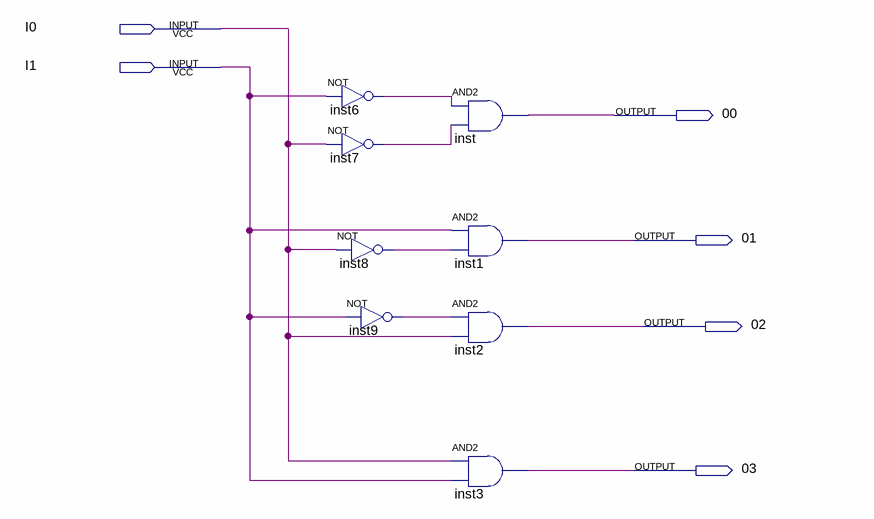
[diagram p0: schematic sheet]
// Quartus schematic decoder_2x4.bdf as structural Verilog: 8 symbols, 6 pins
module decoder_2x4 (
  input  I0,
  input  I1,
  output \00 ,
  output \01 ,
  output \02 ,
  output \03 
);

  wire inst6_out, inst7_out, inst8_out, inst9_out;

  not inst6 (inst6_out, I1);
  not inst7 (inst7_out, I0);
  not inst8 (inst8_out, I0);
  not inst9 (inst9_out, I1);
  and inst (\00 , inst6_out, inst7_out);
  and inst1 (\01 , I1, inst8_out);
  and inst2 (\02 , inst9_out, I0);
  and inst3 (\03 , I0, I1);
endmodule
